# EAGLE design dyna-comp (EAGLE 9.6.2)
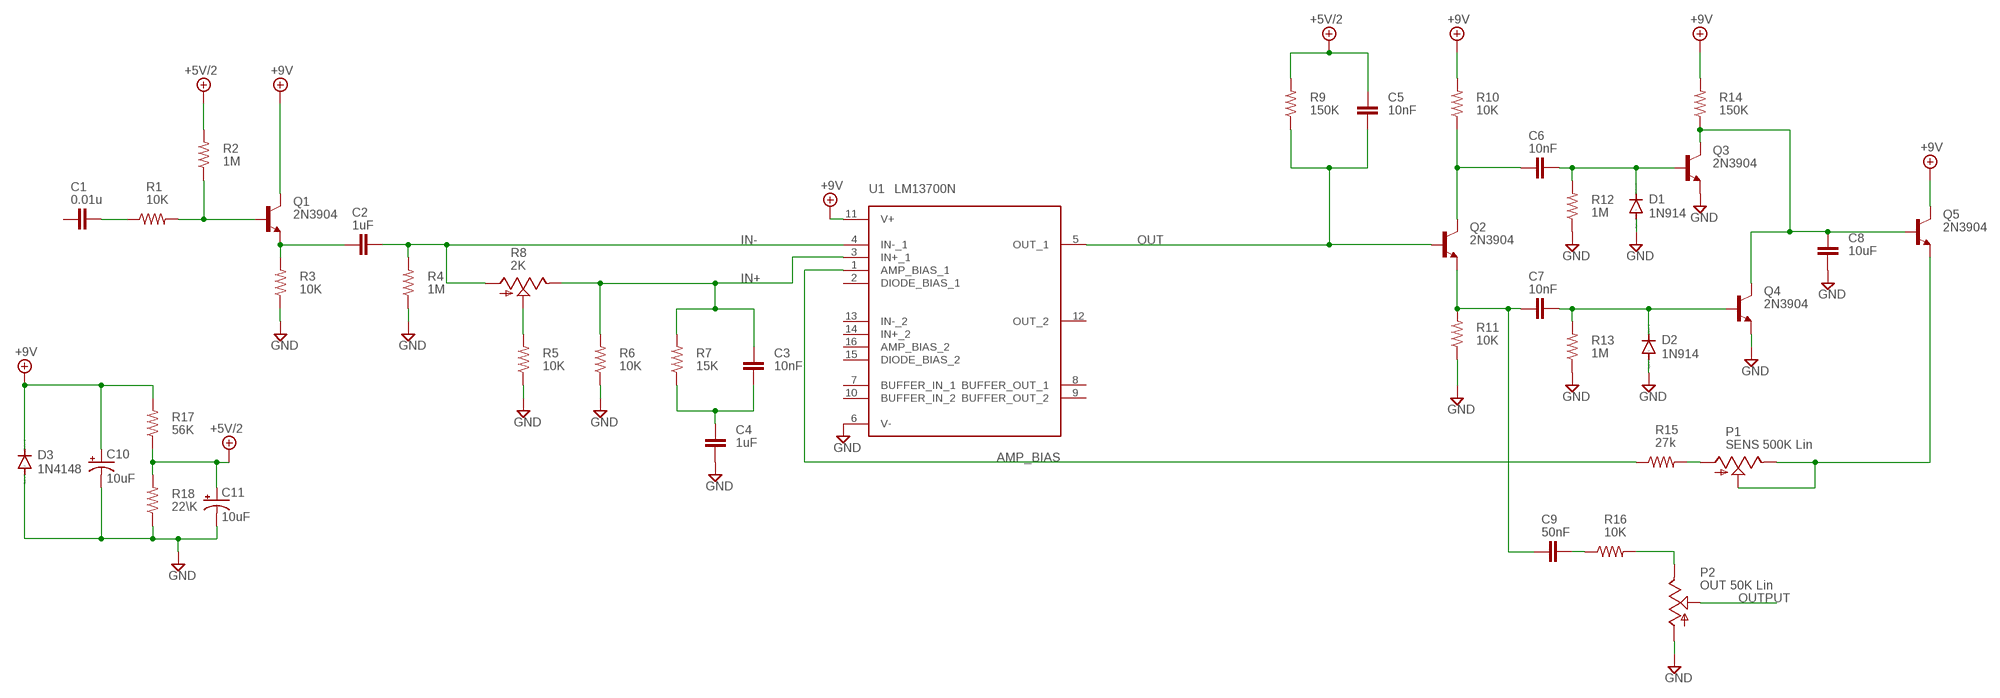
[diagram p0: schematic, sheet 1]

## Parts
C1  0.01u  C-EU050-024X044  [C050-024X044]
C2  1uF  C-EU050-024X044  [C050-024X044]
C3  10nF  C-EU050-024X044  [C050-024X044]
C4  1uF  C-EU050-024X044  [C050-024X044]
C5  10nF  C-EU050-024X044  [C050-024X044]
C6  10nF  C-EU050-024X044  [C050-024X044]
C7  10nF  C-EU050-024X044  [C050-024X044]
C8  10uF  C-EU050-024X044  [C050-024X044]
C9  50nF  C-EU050-024X044  [C050-024X044]
C10  10uF  CPOL-USTT2D5  [TT2D5]
C11  10uF  CPOL-USTT2D5  [TT2D5]
D1  1N914  1N4148DO35-7  [DO35-7]
D2  1N914  1N4148DO35-7  [DO35-7]
D3  1N4148  1N4148DO35-7  [DO35-7]
P1  SENS 500K Lin  POT  [POT-5.08MM]
P2  OUT 50K Lin  POT  [POT-5.08MM]
Q1  2N3904  -NPN-TO92  [TO92]
Q2  2N3904  -NPN-TO92  [TO92]
Q3  2N3904  -NPN-TO92  [TO92]
Q4  2N3904  -NPN-TO92  [TO92]
Q5  2N3904  -NPN-TO92  [TO92]
R1  10K  R-US_0309/12  [0309/12]
R2  1M  R-US_0309/12  [0309/12]
R3  10K  R-US_0309/12  [0309/12]
R4  1M  R-US_0309/12  [0309/12]
R5  10K  R-US_0309/12  [0309/12]
R6  10K  R-US_0309/12  [0309/12]
R7  15K  R-US_0309/12  [0309/12]
R8  2K  TRIM_US-CA6V  [CA6V]
R9  150K  R-US_0309/12  [0309/12]
R10  10K  R-US_0309/12  [0309/12]
R11  10K  R-US_0309/12  [0309/12]
R12  1M  R-US_0309/12  [0309/12]
R13  1M  R-US_0309/12  [0309/12]
R14  150K  R-US_0309/12  [0309/12]
R15  27k  R-US_0309/12  [0309/12]
R16  10K  R-US_0309/12  [0309/12]
R17  56K  R-US_0309/12  [0309/12]
R18  22\K  R-US_0309/12  [0309/12]
U1  LM13700N  [DIL16]

## Nets
+5V/2: C5.1 C11.+ R2.2 R9.2 R17.1 R18.2
+9V: C10.+ D3.C Q1.3(C) Q5.3(C) R10.2 R14.2 R17.2 U1.11(V+)
AMP_BIAS: R15.1 U1.1(AMP_BIAS_1)
GND: C4.2 C8.2 C10.- C11.- D1.A D2.A D3.A P2.1 Q3.1(E) Q4.1(E) R3.1 R4.1 R5.1 R6.1 R11.1 R12.1 R13.1 R18.1 U1.6(V-)
IN+: C3.1 R6.2 R7.2 R8.E U1.3(IN+_1)
IN-: C2.2 R4.2 R8.A U1.4(IN-_1)
N$1: C1.2 R1.1
N$2: Q1.2(B) R1.2 R2.1
N$3: C6.1 Q2.3(C) R10.1
N$4: C2.1 Q1.1(E) R3.2
N$5: R5.2 R8.S
N$6: C7.1 C9.1 Q2.1(E) R11.2
N$7: C6.2 D1.C Q3.2(B) R12.2
N$8: C3.2 C4.1 R7.1
N$9: C7.2 D2.C Q4.2(B) R13.2
N$10: P1.2 P1.3 Q5.1(E)
N$11: C8.1 Q3.3(C) Q4.3(C) Q5.2(B) R14.1
N$12: P1.1 R15.2
N$14: P2.3 R16.2
N$15: C9.2 R16.1
OUT: C5.2 Q2.2(B) R9.1 U1.5(OUT_1)
OUTPUT: P2.2
Unconnected: C1.1 U1.2(DIODE_BIAS_1) U1.7(BUFFER_IN_1) U1.8(BUFFER_OUT_1) U1.9(BUFFER_OUT_2) U1.10(BUFFER_IN_2) U1.12(OUT_2) U1.13(IN-_2) U1.14(IN+_2) U1.15(DIODE_BIAS_2) U1.16(AMP_BIAS_2)

## Library data of the parts
C1-C9 = rcl:C-EU: CAPACITOR, European symbol; SPICEPREFIX: C
C10 C11 = rcl:CPOL-US: POLARIZED CAPACITOR, American symbol; SPICEPREFIX: C
D1-D3 = diode:1N4148: DIODE high speed (Philips)
P1 P2 = guitar-pedals:POT
Q1-Q5 = transistor:*-NPN-: NPN Transistror BF959 corrected 2008.03.06
R1-R7 R9-R18 = rcl:R-US_: RESISTOR, American symbol; SPICEPREFIX: R
R8 = pot:TRIM_US-: POTENTIOMETER
U1 = guitar-pedals:LM13700N

## Board
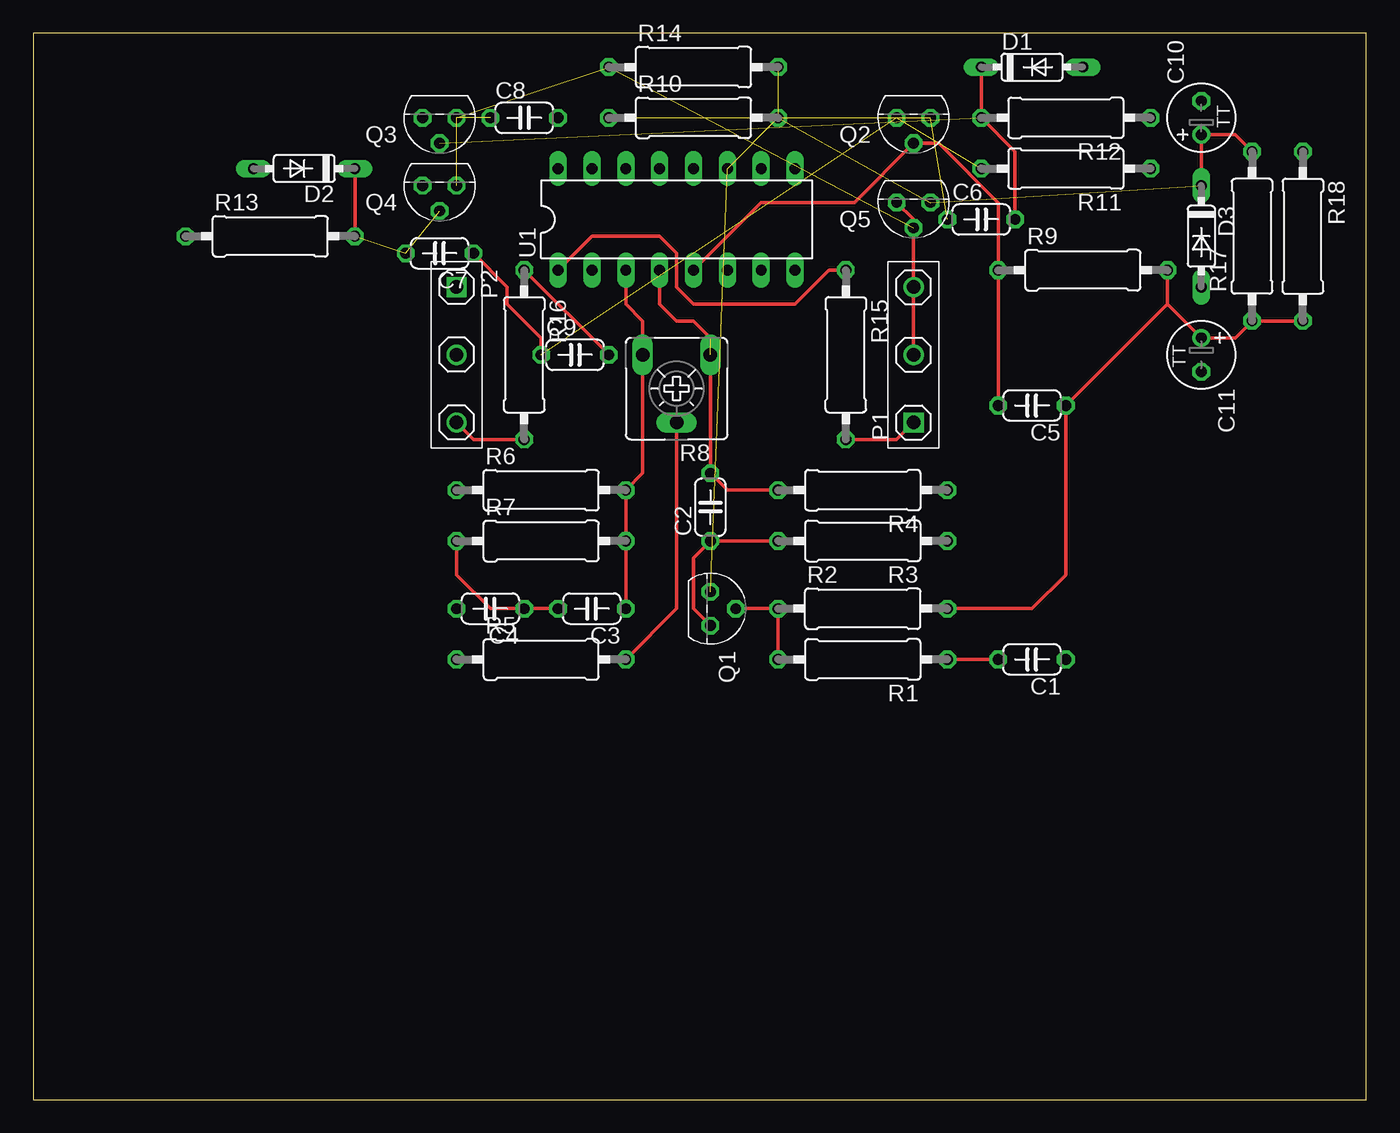
[diagram p1: board, top side]
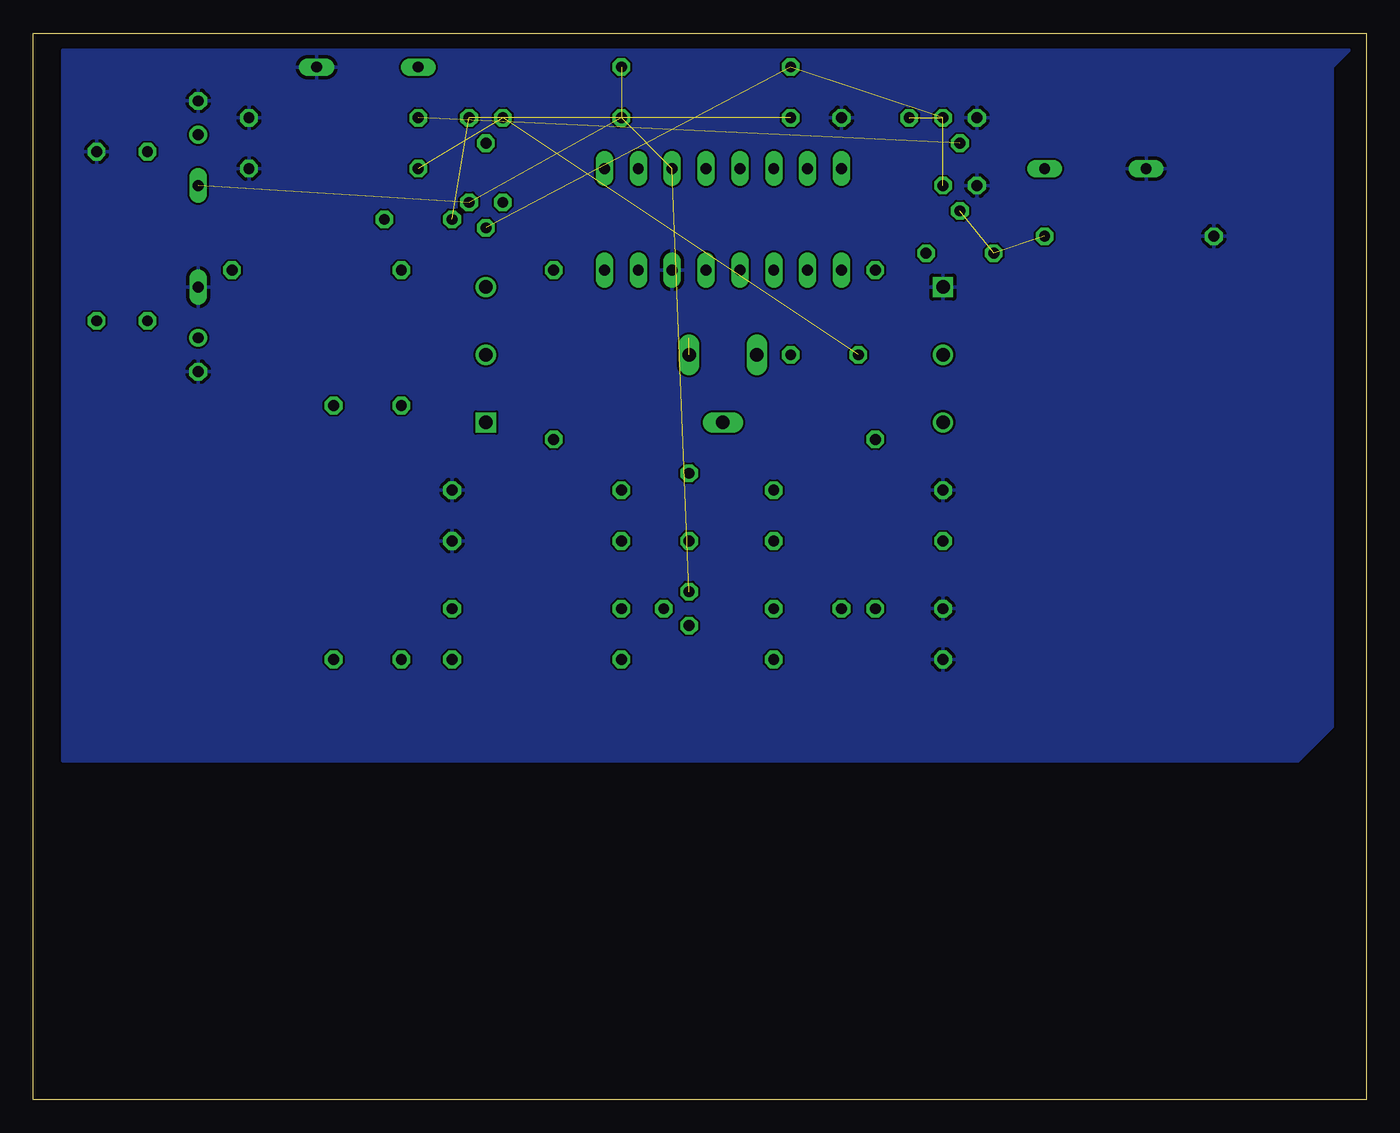
[diagram p2: board, bottom side, seen from below]

Size 100 x 80 mm. Coordinates in mm from the lower left corner, seen from the top.
Outline: 0,0 100,0 100,80 0,80 0,0
Copper layers (1*16): Top 0.035mm / dielectric 1.5mm / Bottom 0.035mm
Design rules "default": minimum track width 6mil, minimum drill 0.35mm, track to track 6mil, track to pad 6mil, pad to pad 6mil, via to via 6mil, smd to smd 6mil, copper to edge 40mil, drill to drill 6mil, minimum pad ring 10mil, minimum via ring 8mil, stop-mask expansion 4mil, vias tented up to drill 0mil, thermal gap 10mil

### Footprints (pad centres in the part's own frame; a part is rotated, then mirrored left to right if it is on the bottom)
C050-024X044 = drill 0.813 octagon: 1 -2.54,0; 2 2.54,0
TT2D5 = drill 0.813: + -1.27,0 | drill 0.813 octagon: - 1.27,0
DO35-7 = drill 0.813 long: A 3.81,0; C -3.81,0
POT-5.08MM = drill 1.016 square: 1 -5.08,0 | drill 1.016: 2 0,0; 3 5.08,0
TO92 = drill 0.813 octagon: 1 1.27,0; 2 0,1.905; 3 -1.27,0
0309/12 = drill 0.813 octagon: 1 -6.35,0; 2 6.35,0
CA6V = drill 1.016 long: A -2.54,-2.54; E 2.54,-2.54; S 0,2.54
DIL16 = drill 0.813 long: 1 -8.89,-3.81; 2 -6.35,-3.81; 3 -3.81,-3.81; 4 -1.27,-3.81; 5 1.27,-3.81; 6 3.81,-3.81; 7 6.35,-3.81; 8 8.89,-3.81; 9 8.89,3.81; 10 6.35,3.81; 11 3.81,3.81; 12 1.27,3.81; 13 -1.27,3.81; 14 -3.81,3.81; 15 -6.35,3.81; 16 -8.89,3.81

### Placement (x,y rotation side)
C1  74.93,33.02 180 top
C2  50.8,44.45 90 top
C3  41.91,36.83 180 top
C4  34.29,36.83 180 top
C5  74.93,52.07 180 top
C6  71.12,66.04 0 top
C7  30.48,63.5 180 top
C8  36.83,73.66 0 top
C9  40.64,55.88 0 top
C10  87.63,73.66 90 top
C11  87.63,55.88 270 top
D1  74.93,77.47 0 top
D2  20.32,69.85 180 top
D3  87.63,64.77 270 top
P1  66.04,55.88 90 top
P2  31.75,55.88 270 top
Q1  50.8,36.83 270 top
Q2  66.04,73.66 180 top
Q3  30.48,73.66 180 top
Q4  30.48,68.58 180 top
Q5  66.04,67.31 180 top
R1  62.23,33.02 180 top
R2  62.23,36.83 0 top
R3  62.23,41.91 180 top
R4  62.23,45.72 180 top
R5  38.1,33.02 0 top
R6  38.1,45.72 0 top
R7  38.1,41.91 0 top
R8  48.26,53.34 180 top
R9  78.74,62.23 0 top
R10  49.53,73.66 0 top
R11  77.47,69.85 180 top
R12  77.47,73.66 180 top
R13  17.78,64.77 0 top
R14  49.53,77.47 0 top
R15  60.96,55.88 270 top
R16  36.83,55.88 270 top
R17  91.44,64.77 90 top
R18  95.25,64.77 270 top
U1  48.26,66.04 0 top

### Tracks (layer width: path | path; a pad name or v marks a point on that pad's centre or on a via)
+5V/2
  Top 0.254: R18.2 R17.1 90.17,57.15 C11.+ 85.09,59.69 | 85.09,59.69 R9.2 | 85.09,59.69 C5.1 77.47,39.37 74.93,36.83 R2.2
+9V  (5 unrouted)
  Top 0.254: D3.C C10.+ 90.17,72.39 R17.2
AMP_BIAS
  Top 0.254: U1.1 41.91,64.77 46.99,64.77 48.26,63.5 48.26,60.96 49.53,59.69 57.15,59.69 59.69,62.23 R15.1
GND
  pour Bottom: 1.27,78.74 97.79,78.74 97.79,25.4 5.08,25.4 2.54,27.94 2.54,77.47
IN+
  Top 0.254: C3.1 R7.2 R6.2 45.72,46.99 R8.E 45.72,58.42 44.45,59.69 U1.3
IN-  (1 unrouted)
  Top 0.254: U1.4 46.99,59.69 48.26,58.42 49.53,58.42 50.8,57.15 | R8.A C2.2 52.07,45.72 R4.2
N$1
  Top 0.254: C1.2 R1.1
N$2
  Top 0.254: Q1.2 R2.1 R1.2
N$3  (2 unrouted)
N$4
  Top 0.254: R3.2 C2.1 49.53,40.64 49.53,36.83 Q1.1
N$5
  Top 0.254: R8.S 48.26,36.83 R5.2
N$6  (2 unrouted)
  Top 0.254: C7.1 35.56,60.96 35.56,59.69 38.1,57.15 C9.1
N$7  (1 unrouted)
  Top 0.254: D1.C R12.2 73.66,71.12 C6.2
N$8
  Top 0.254: C3.2 C4.1 34.29,36.83 31.75,39.37 R7.1
N$9  (2 unrouted)
  Top 0.254: D2.C R13.2
N$10
  Top 0.254: P1.2 P1.3 66.04,66.04 Q5.1
N$11  (4 unrouted)
N$12
  Top 0.254: P1.1 64.77,49.53 R15.2
N$14
  Top 0.254: R16.2 33.02,49.53 P2.3
N$15
  Top 0.254: R16.1 C9.2
OUT
  Top 0.254: C5.2 R9.1 72.39,67.25 70.18,69.46 70.18,69.52 67.94,71.75 Q2.2 61.59,67.31 54.61,67.31 U1.5